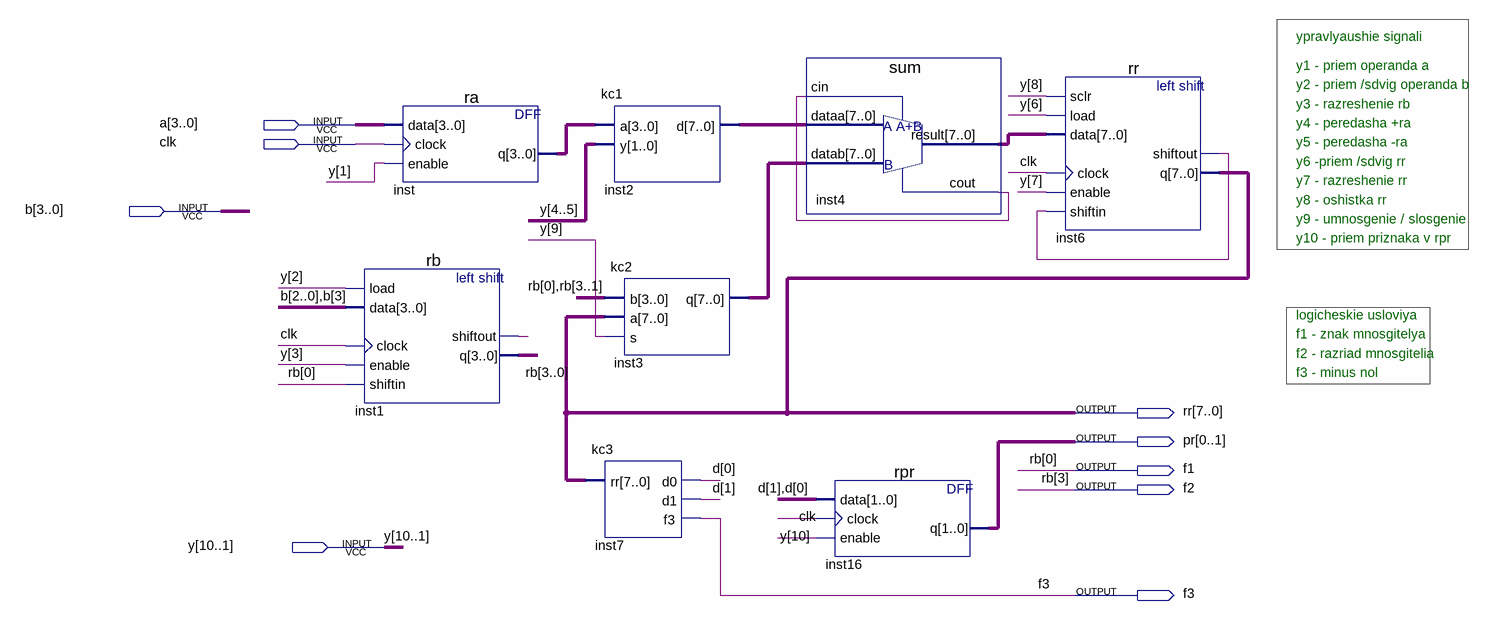
[diagram p0: schematic sheet]
// Quartus schematic blok_oper_sch.bdf as structural Verilog: 8 symbols, 9 pins
module blok_oper_sch (
  input  [3:0] a,
  input  clk,
  input  [3:0] b,
  input  [10:1] y,
  output [7:0] rr,
  output [0:1] pr,
  output f1,
  output f2,
  output f3
);

  wire inst1_shiftout, inst4_cout, inst6_shiftout;
  wire [1:0] d;
  wire [2:1] rb;
  wire [3:0] inst_q;
  wire [7:0] inst2_d, inst3_q, inst4_result;

  ra inst (.data(a), .clock(clk), .enable(y[1]), .q(inst_q));
  rb inst1 (
    .load(y[2]), .data({b[2:0], b[3]}), .clock(clk), .enable(y[3]), .shiftin(f1), .shiftout(inst1_shiftout),
    .q({f2, rb, f1}));
  kc1 inst2 (.a(inst_q), .y({y[4], y[5]}), .d(inst2_d));
  kc2 inst3 (.b({f1, f2, rb}), .a(rr), .s(y[9]), .q(inst3_q));
  kc3 inst7 (.rr(rr), .d0(d[0]), .d1(d[1]), .f3(f3));
  sum inst4 (.cin(inst4_cout), .dataa(inst2_d), .datab(inst3_q), .result(inst4_result), .cout(inst4_cout));
  rpr inst16 (.data(d), .clock(clk), .enable(y[10]), .q(pr));
  rr inst6 (
    .sclr(y[8]), .load(y[6]), .data(inst4_result), .clock(clk), .enable(y[7]), .shiftin(inst6_shiftout),
    .shiftout(inst6_shiftout), .q(rr));

  // Other names for the same wires on the sheet: rb (some bits) = {f2, f1}

  // Notes on the sheet:
  //   ypravlyaushie signali
  //   y1 - priem operanda a
  //   y2 - priem /sdvig operanda b
  //   y3 - razreshenie rb
  //   y4 - peredasha +ra
  //   y5 - peredasha -ra
  //   y6 -priem /sdvig rr
  //   y7 - razreshenie rr
  //   y8 - oshistka rr
  //   y9 - umnosgenie / slosgenie
  //   y10 - priem priznaka v rpr
  //   logicheskie usloviya
  //   f1 - znak mnosgitelya
  //   f2 - razriad mnosgitelia
  //   f3 - minus nol
endmodule
